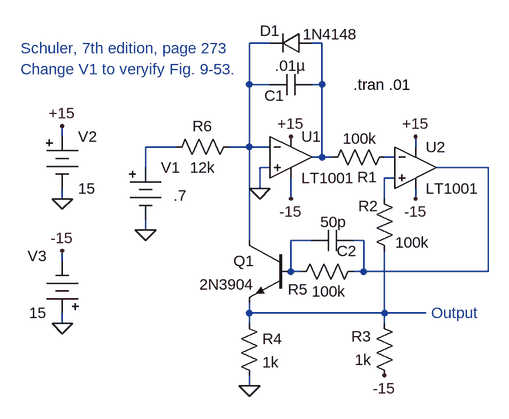
[diagram p0: schematic VoltageToFreq.asc]
VoltageToFreq.asc, the LTspice schematic file:
Version 4
SHEET 1 880 680
WIRE -608 -496 -640 -496
WIRE -528 -496 -544 -496
WIRE -640 -432 -640 -496
WIRE -608 -432 -640 -432
WIRE -528 -432 -528 -496
WIRE -528 -432 -544 -432
WIRE -928 -352 -928 -368
WIRE -752 -336 -800 -336
WIRE -640 -336 -640 -432
WIRE -640 -336 -672 -336
WIRE -608 -336 -640 -336
WIRE -384 -336 -384 -352
WIRE -528 -320 -528 -432
WIRE -528 -320 -544 -320
WIRE -512 -320 -528 -320
WIRE -416 -320 -432 -320
WIRE -800 -304 -800 -336
WIRE -608 -304 -624 -304
WIRE -272 -304 -352 -304
WIRE -416 -288 -432 -288
WIRE -624 -272 -624 -304
WIRE -928 -256 -928 -272
WIRE -576 -256 -576 -288
WIRE -432 -256 -432 -288
WIRE -384 -256 -384 -272
WIRE -800 -208 -800 -224
WIRE -640 -192 -640 -336
WIRE -544 -192 -576 -192
WIRE -464 -192 -480 -192
WIRE -928 -160 -928 -176
WIRE -576 -144 -576 -192
WIRE -560 -144 -576 -144
WIRE -464 -144 -464 -192
WIRE -464 -144 -480 -144
WIRE -272 -144 -272 -304
WIRE -272 -144 -464 -144
WIRE -640 -80 -640 -96
WIRE -432 -80 -432 -176
WIRE -432 -80 -640 -80
WIRE -368 -80 -432 -80
WIRE -928 -64 -928 -80
WIRE -640 -64 -640 -80
WIRE -432 -64 -432 -80
WIRE -640 32 -640 16
FLAG -576 -352 +15
FLAG -576 -256 -15
FLAG -384 -256 -15
FLAG -384 -352 +15
FLAG -624 -272 0
FLAG -640 32 0
FLAG -432 16 -15
FLAG -928 -176 -15
FLAG -928 -368 +15
FLAG -928 -256 0
FLAG -928 -64 0
FLAG -800 -208 0
SYMBOL Opamps\\LT1001 -576 -384 R0
SYMATTR InstName U1
SYMBOL Opamps\\LT1001 -384 -368 R0
SYMATTR InstName U2
SYMBOL res -416 -336 R90
WINDOW 0 62 42 VBottom 0
WINDOW 3 -28 54 VTop 0
SYMATTR InstName R1
SYMATTR Value 100k
SYMBOL res -416 -160 R180
WINDOW 0 25 85 Left 0
WINDOW 3 -53 29 Left 0
SYMATTR InstName R2
SYMATTR Value 100k
SYMBOL res -416 32 R180
WINDOW 0 36 76 Left 0
WINDOW 3 36 40 Left 0
SYMATTR InstName R3
SYMATTR Value 1k
SYMBOL npn -576 -192 M0
SYMATTR InstName Q1
SYMATTR Value 2N3904
SYMBOL res -656 -80 R0
SYMATTR InstName R4
SYMATTR Value 1k
SYMBOL res -464 -160 R90
WINDOW 0 59 101 VBottom 0
WINDOW 3 31 53 VTop 0
SYMATTR InstName R5
SYMATTR Value 100k
SYMBOL cap -544 -448 R90
WINDOW 0 49 57 VBottom 0
WINDOW 3 -29 33 VTop 0
SYMATTR InstName C1
SYMATTR Value .01µ
SYMBOL diode -544 -512 R90
WINDOW 0 13 64 VBottom 0
WINDOW 3 -13 -29 VTop 0
SYMATTR InstName D1
SYMATTR Value 1N4148
SYMBOL res -656 -352 R90
WINDOW 0 0 56 VBottom 0
WINDOW 3 32 56 VTop 0
SYMATTR InstName R6
SYMATTR Value 12k
SYMBOL cap -480 -208 R90
WINDOW 0 48 10 VBottom 0
WINDOW 3 -28 30 VTop 0
SYMATTR InstName C2
SYMATTR Value 50p
SYMBOL Misc\\battery -800 -320 R0
WINDOW 3 43 59 Left 0
WINDOW 123 0 0 Left 0
WINDOW 39 0 0 Left 0
SYMATTR InstName V1
SYMATTR Value .7
SYMBOL Misc\\battery -928 -368 R0
WINDOW 123 0 0 Left 0
WINDOW 39 0 0 Left 0
SYMATTR InstName V2
SYMATTR Value 15
SYMBOL Misc\\battery -928 -64 R180
WINDOW 0 24 104 Left 0
WINDOW 3 24 16 Left 0
WINDOW 123 0 0 Left 0
WINDOW 39 0 0 Left 0
SYMATTR InstName V3
SYMATTR Value 15
TEXT -480 -432 Left 0 !.tran .01
TEXT -360 -80 Left 0 ;Output
TEXT -992 -488 Left 0 ;Schuler, 7th edition, page 273
TEXT -992 -456 Left 0 ;Change V1 to veryify Fig. 9-53.

The netlist it stands for:
* VoltageToFreq.asc
XU1 0 N001 +15 -15 N002 LT1001  ; pins In+ In- V+ V- OUT
XU2 N006 N004 +15 -15 N005 LT1001  ; pins In+ In- V+ V- OUT
R1 N004 N002 100k
R2 N008 N006 100k
R3 -15 N008 1k
Q1 N001 N007 N008 0 2N3904
R4 N008 0 1k
R5 N005 N007 100k
C1 N002 N001 .01µ
D1 N002 N001 1N4148
R6 N001 N003 12k
C2 N005 N007 50p
V1 N003 0 .7
V2 +15 0 15
V3 0 -15 15
.model D D
.lib standard.dio
.model NPN NPN
.model PNP PNP
.lib standard.bjt
.tran .01
* Output
* Schuler, 7th edition, page 273
* Change V1 to veryify Fig. 9-53.
.lib LTC.lib
.backanno
.end